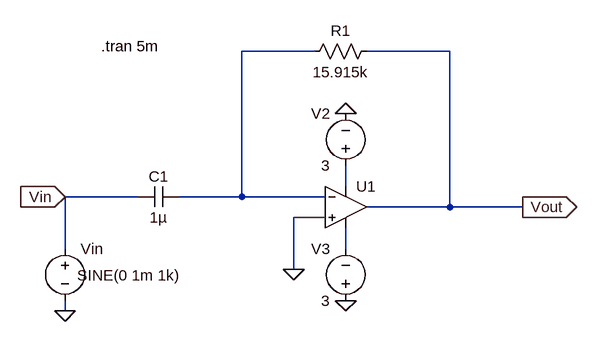
[diagram p0: schematic OpAmp_Differentiator.asc]
OpAmp_Differentiator.asc, the LTspice schematic file:
Version 4
SHEET 1 880 680
WIRE 272 -80 160 -80
WIRE 480 -80 352 -80
WIRE 320 128 320 96
WIRE 0 144 -112 144
WIRE 160 144 160 -80
WIRE 160 144 64 144
WIRE 288 144 160 144
WIRE 480 160 480 -80
WIRE 480 160 352 160
WIRE 592 160 480 160
WIRE 288 176 240 176
WIRE -112 224 -112 144
WIRE 320 224 320 192
WIRE 240 256 240 176
WIRE -112 320 -112 304
FLAG 320 16 0
FLAG 320 304 0
FLAG 240 256 0
FLAG -112 320 0
FLAG 592 160 Vout
IOPIN 592 160 Out
FLAG -112 144 Vin
IOPIN -112 144 In
SYMBOL voltage -112 208 R0
WINDOW 3 19 57 Left 2
WINDOW 123 0 0 Left 0
WINDOW 39 0 0 Left 0
SYMATTR Value SINE(0 1m 1k)
SYMATTR InstName Vin
SYMBOL voltage 320 112 R180
WINDOW 0 24 96 Left 2
WINDOW 3 24 16 Left 2
SYMATTR InstName V2
SYMATTR Value 3
SYMBOL voltage 320 320 R180
WINDOW 0 24 96 Left 2
WINDOW 3 24 16 Left 2
SYMATTR InstName V3
SYMATTR Value 3
SYMBOL cap 64 128 R90
WINDOW 0 0 32 VBottom 2
WINDOW 3 32 32 VTop 2
SYMATTR InstName C1
SYMATTR Value 1µ
SYMBOL res 368 -96 R90
WINDOW 0 0 56 VBottom 2
WINDOW 3 32 56 VTop 2
SYMATTR InstName R1
SYMATTR Value 15.915k
SYMBOL Opamps\\UniversalOpamp2 320 160 R0
SYMATTR InstName U1
SYMATTR Value2 Avol=1Meg GBW=100000Meg Slew=10Meg
TEXT -56 -88 Left 2 !.tran 5m

The netlist it stands for:
* OpAmp_Differentiator.asc
Vin Vin 0 SINE(0 1m 1k)
V2 N002 0 3
V3 0 N003 3
C1 N001 Vin 1µ
R1 Vout N001 15.915k
XU1 0 N001 N002 N003 Vout level.2 Avol=1Meg GBW=100000Meg Slew=10Meg ilimit=25m rail=0 Vos=0 phimargin=45 en=0 enk=0 in=0 ink=0 Rin=500Meg  ; pins IN+ IN- V+ V- OUT
.tran 5m
.lib UniversalOpamps2.sub
.backanno
.end